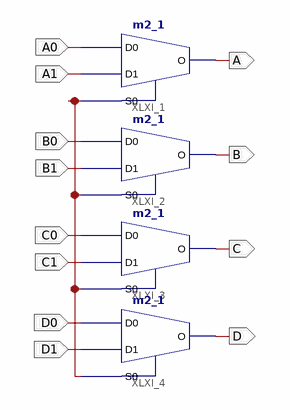
[diagram p0: schematic sheet 1]
// Xilinx ISE schematic MuxA_D.sch (spartan6) as structural Verilog: 4 symbols, 12 ports
module MuxA_D (
  input  A0,
  input  A1,
  input  B0,
  input  B1,
  input  C0,
  input  C1,
  input  D0,
  input  D1,
  output A,
  output B,
  output C,
  output D
);

  wire CLK;

  m2_1 XLXI_1 (.D0(A0), .D1(A1), .S0(CLK), .O(A));
  m2_1 XLXI_2 (.D0(B0), .D1(B1), .S0(CLK), .O(B));
  m2_1 XLXI_3 (.D0(C0), .D1(C1), .S0(CLK), .O(C));
  m2_1 XLXI_4 (.D0(D0), .D1(D1), .S0(CLK), .O(D));
endmodule
